# Altium schematic sheet [X] - ETHERNET.SchDoc
size 513 x 386 mm
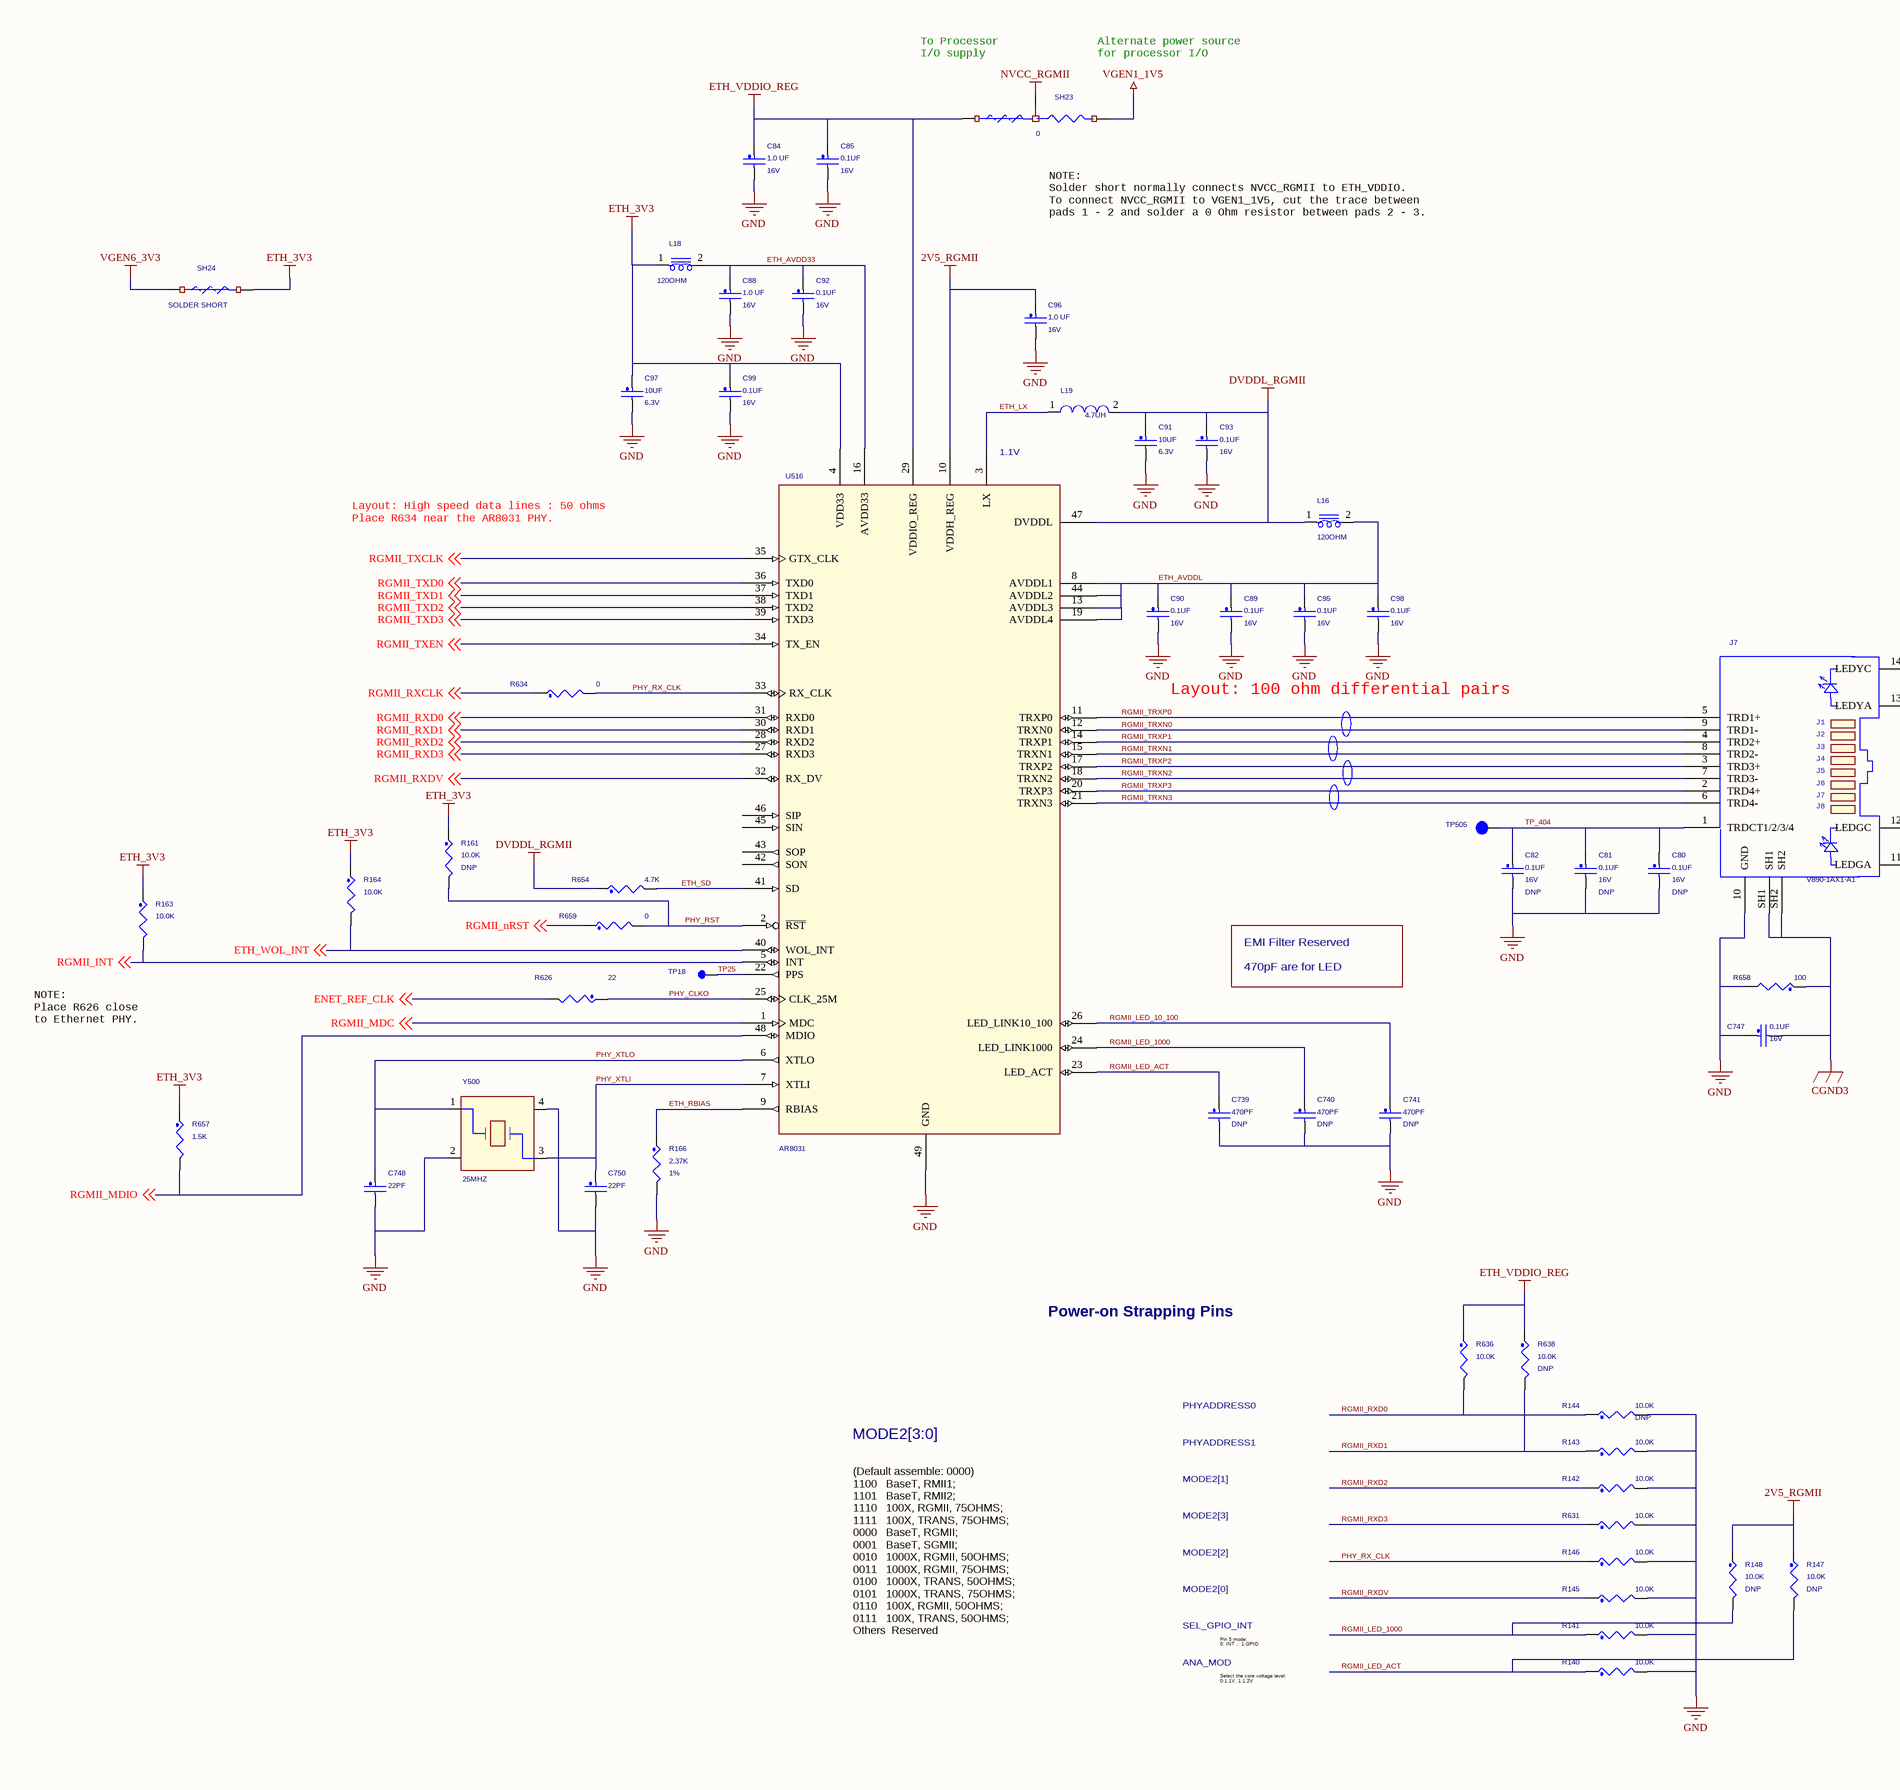
[diagram p0: [X] - ETHERNET.SchDoc, left]
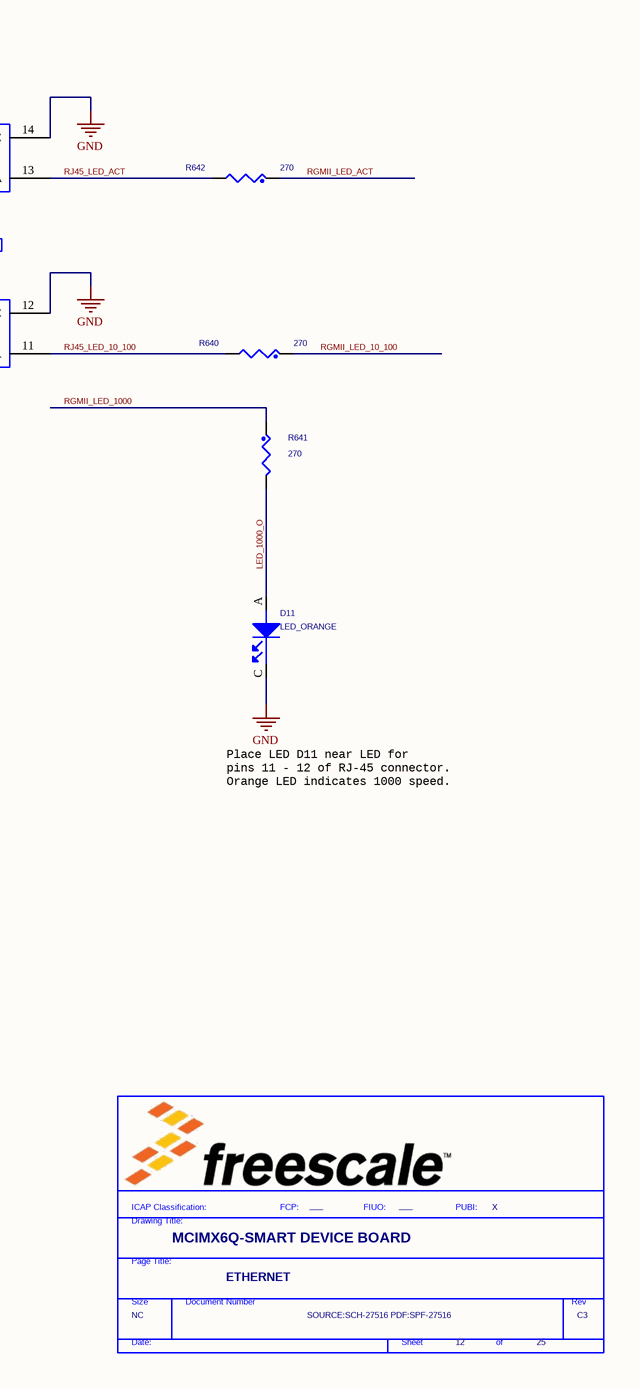
[diagram p1: [X] - ETHERNET.SchDoc, right]

## Parts
*  FIUO: ___  PUBI: X  Doc: SOURCE:SCH-27516 PDF:SPF-27516  RevCode: C3  Title: MCIMX6Q-SMART DEVICE BOARD  Page Size: NC  Page Number: 12  Page Count: 25  PageTitle: ETHERNET  (hidden comment: TitleBlock_FS)  (graphical)
C80  0.1UF  WVDC: 16V  ASSY_OPT: DNP  [0402_CC]
C81  0.1UF  WVDC: 16V  ASSY_OPT: DNP  [0402_CC]
C82  0.1UF  WVDC: 16V  ASSY_OPT: DNP  [0402_CC]
C84  1.0 UF  WVDC: 16V  [0603_CC]
C85  0.1UF  WVDC: 16V  [0402_CC]
C88  1.0 UF  WVDC: 16V  [0603_CC]
C89  0.1UF  WVDC: 16V  [0402_CC]
C90  0.1UF  WVDC: 16V  [0402_CC]
C91  10UF  WVDC: 6.3V  [0603_CC]
C92  0.1UF  WVDC: 16V  [0402_CC]
C93  0.1UF  WVDC: 16V  [0402_CC]
C95  0.1UF  WVDC: 16V  [0402_CC]
C96  1.0 UF  WVDC: 16V  [0603_CC]
C97  10UF  WVDC: 6.3V  [0603_CC]
C98  0.1UF  WVDC: 16V  [0402_CC]
C99  0.1UF  WVDC: 16V  [0402_CC]
C739  470PF  ASSY_OPT: DNP  [0402_CC]
C740  470PF  ASSY_OPT: DNP  [0402_CC]
C741  470PF  ASSY_OPT: DNP  [0402_CC]
C747  0.1UF  WVDC: 16V  [0402_CC]
C748  22PF  [0402_CC]
C750  22PF  [0402_CC]
D11  LED_ORANGE  [LED_0603]
J7  V890-1AX1-A1  [con_rj45_2x5_th]
L16  120OHM  [0603_CC]
L18  120OHM  [0603_CC]
L19  4.7UH  [ind_vls3012_sm]
R140  10.0K  [0402_CC]
R141  10.0K  [0402_CC]
R142  10.0K  [0402_CC]
R143  10.0K  [0402_CC]
R144  10.0K  ASSY_OPT: DNP  [0402_CC]
R145  10.0K  [0402_CC]
R146  10.0K  [0402_CC]
R147  10.0K  ASSY_OPT: DNP  [0402_CC]
R148  10.0K  ASSY_OPT: DNP  [0402_CC]
R161  10.0K  ASSY_OPT: DNP  [0402_CC]
R163  10.0K  [0402_CC]
R164  10.0K  [0402_CC]
R166  2.37K  Tolerance: 1%  [0402_CC]
R626  22  [0603_CC]
R631  10.0K  [0402_CC]
R634  0  [0402_CC]
R636  10.0K  [0402_CC]
R638  10.0K  ASSY_OPT: DNP  [0402_CC]
R640  270  [0402_CC]
R641  270  [0402_CC]
R642  270  [0402_CC]
R654  4.7K  [0402_CC]
R657  1.5K  [0402_CC]
R658  100  [0402_CC]
R659  0  [0402_CC]
SH23  0  [SH0603-X2_PIN1TO2]
SH24  SOLDER SHORT  [SH0805_40]
TP18  TEST POINT  [C035S]  (value not drawn)
TP505  tpad_020  [tpad_020]  (value not drawn)
U516  AR8031  [qfn48_0p4_6x6mm_epad]
Y500  25MHZ  [xtal_4_7p2x5p2]

## Nets
2V5_RGMII: C96.1 R147.1 R148.1 U516.10(VDDH_REG)
CGND3: C747.2 J7.SH1 J7.SH2 R658.1
DVDDL_RGMII: C91.1 C93.1 L16.1 L19.2 R654.1 U516.47(DVDDL)
ETH_3V3: C97.1 C99.1 L18.1 R161.1 R163.1 R164.1 R657.1 SH24.2 U516.4(VDD33)
ETH_VDDIO_REG: C84.1 C85.1 R636.1 R638.1 SH23.1 U516.29(VDDIO_REG)
GND: C80.2 C81.2 C82.2 C84.2 C85.2 C88.2 C89.2 C90.2 C91.2 C92.2 C93.2 C95.2 C96.2 C97.2 C98.2 C99.2 C739.2 C740.2 C741.2 C747.1 C748.2 C750.2 D11.C(CATHODE) J7.10(GND) J7.12(LEDGC) J7.14(LEDYC) R140.2 R141.2 R142.2 R143.2 R144.2 R145.2 R146.2 R166.2 R631.2 R658.2 U516.49(GND) Y500.2 Y500.4
NVCC_RGMII: SH23.2
VGEN1_1V5: SH23.3
VGEN6_3V3: SH24.1
ENET_REF_CLK: R626.2 ; off-sheet ENET_REF_CLK
ETH_AVDD33: C88.1 C92.1 L18.2 U516.16(AVDD33)
ETH_AVDDL: C89.1 C90.1 C95.1 C98.1 L16.2 U516.8(AVDDL1) U516.13(AVDDL3) U516.19(AVDDL4) U516.44(AVDDL2)
ETH_LX: L19.1 U516.3(LX)
ETH_RBIAS: R166.1 U516.9(RBIAS)
ETH_SD: R654.2 U516.41(SD)
ETH_WOL_INT: R164.2 U516.40(WOL_INT) ; off-sheet ETH_WOL_INT
LED_1000_O: D11.A(ANODE) R641.2
PHY_CLKO: R626.1 U516.25(CLK_25M)
PHY_RST: R161.2 R659.2 U516.2(~{RST})
PHY_RX_CLK: R146.1 R634.2 U516.33(RX_CLK)
PHY_XTLI: C750.1 U516.7(XTLI) Y500.3
PHY_XTLO: C748.1 U516.6(XTLO) Y500.1
RGMII_INT: R163.2 U516.5(INT) ; off-sheet RGMII_INT
RGMII_LED_10_100: C741.1 R640.1 U516.26(LED_LINK10_100)
RGMII_LED_1000: C740.1 R141.1 R148.2 R641.1 U516.24(LED_LINK1000)
RGMII_LED_ACT: C739.1 R140.1 R147.2 R642.1 U516.23(LED_ACT)
RGMII_MDC: U516.1(MDC) ; off-sheet RGMII_MDC
RGMII_MDIO: R657.2 U516.48(MDIO) ; off-sheet RGMII_MDIO
RGMII_nRST: R659.1 ; off-sheet RGMII_nRST
RGMII_RXCLK: R634.1 ; off-sheet RGMII_RXCLK
RGMII_RXD0: R144.1 R636.2 U516.31(RXD0) ; off-sheet RGMII_RXD0
RGMII_RXD1: R143.1 R638.2 U516.30(RXD1) ; off-sheet RGMII_RXD1
RGMII_RXD2: R142.1 U516.28(RXD2) ; off-sheet RGMII_RXD2
RGMII_RXD3: R631.1 U516.27(RXD3) ; off-sheet RGMII_RXD3
RGMII_RXDV: R145.1 U516.32(RX_DV) ; off-sheet RGMII_RXDV
RGMII_TRXN0: J7.9(TRD1-) U516.12(TRXN0)
RGMII_TRXN1: J7.8(TRD2-) U516.15(TRXN1)
RGMII_TRXN2: J7.7(TRD3-) U516.18(TRXN2)
RGMII_TRXN3: J7.6(TRD4-) U516.21(TRXN3)
RGMII_TRXP0: J7.5(TRD1+) U516.11(TRXP0)
RGMII_TRXP1: J7.4(TRD2+) U516.14(TRXP1)
RGMII_TRXP2: J7.3(TRD3+) U516.17(TRXP2)
RGMII_TRXP3: J7.2(TRD4+) U516.20(TRXP3)
RGMII_TXCLK: U516.35(GTX_CLK) ; off-sheet RGMII_TXCLK
RGMII_TXD0: U516.36(TXD0) ; off-sheet RGMII_TXD0
RGMII_TXD1: U516.37(TXD1) ; off-sheet RGMII_TXD1
RGMII_TXD2: U516.38(TXD2) ; off-sheet RGMII_TXD2
RGMII_TXD3: U516.39(TXD3) ; off-sheet RGMII_TXD3
RGMII_TXEN: U516.34(TX_EN) ; off-sheet RGMII_TXEN
RJ45_LED_10_100: J7.11(LEDGA) R640.2
RJ45_LED_ACT: J7.13(LEDYA) R642.2
TP25: TP18.1(Pin1) U516.22(PPS)
TP_404: C80.1 C81.1 C82.1 J7.1(TRDCT1/2/3/4) TP505.1(Pin1)

Not connected (* = marked no-connect by the designer): U516 42(SON) 43(SOP) 45(SIN) 46(SIP)

## Notes on the sheet
- (near SH23) To Processor
  I/O supply
- (near SH23) Alternate power source
  for processor I/O
- NOTE:
  Solder short normally connects NVCC_RGMII to ETH_VDDIO.
  To connect NVCC_RGMII to VGEN1_1V5, cut the trace between
  pads 1 - 2 and solder a 0 Ohm resistor between pads 2 - 3.
- (near U516) 1.1V
- (near U516) Layout: High speed data lines : 50 ohms
  Place R634 near the AR8031 PHY.
- Layout: 100 ohm differential pairs
- EMI Filter Reserved
- NOTE:
  Place R626 close
  to Ethernet PHY.
- 470pF are for LED
- Place LED D11 near LED for
  pins 11 - 12 of RJ-45 connector.
  Orange LED indicates 1000 speed.
- Power-on Strapping Pins
- MODE2[3:0]
- PHYADDRESS0
- (Default assemble: 0000)
  1100   BaseT, RMII1;
  1101   BaseT, RMII2;
  1110   100X, RGMII, 75OHMS;
  1111   100X, TRANS, 75OHMS;
  0000   BaseT, RGMII;
  0001   BaseT, SGMII;
  0010   1000X, RGMII, 50OHMS;
  0011   1000X, RGMII, 75OHMS;
  0100   1000X, TRANS, 50OHMS;
  0101   1000X, TRANS, 75OHMS;
  0110   100X, RGMII, 50OHMS;
  0111   100X, TRANS, 50OHMS;
  Others  Reserved
- PHYADDRESS1
- MODE2[1]
- MODE2[2]
- MODE2[3]
- MODE2[0]
- SEL_GPIO_INT
- ANA_MOD
- Pin 5 mode:
  0: INT ;  1:GPIO
- Select the core voltage level:
  0:1.1V, 1:1.2V
- (in symbol TitleBlock_FS) ICAP Classification:; FCP:; FIUO:; PUBI:; Drawing Title:; Page Title:; Size; Document Number; Rev; Date:; Sheet; of
- (in symbol V890-1AX1-A1_14P) J1; J2; J3; J4; J5; J6; J8

## Library data of the parts
* = TitleBlock_FS: OrgName: Freescale Semiconductor; OrgAddr1: 6501 William Cannon Drive West; OrgAddr2: Austin, TX 78735-8598; FCP: ___; Page Create Date: March  8, 1995
C80-C82 = CAP_NP: CAP CER 0.1UF 16V 10% X7R 0402; CLASS: DISCRETE; ROOM: RGMII_PHY; FPLIST: CC0402_25,CC0402_HD,0402_CC; CAD_APPROVED: Yes; MFG_PN01: C0402C104K4RAC; MFG_NAME01: KEMET; AGILE_PN: 150-75182; PRIORITY_PN: 021-00196; SIGNAL_MODEL: DEFAULT_CAPACITOR_100000pF_2_1; TOL: 10%; HEIGHT: 0.635MM; ROHS: Yes; Tolerance: 10%; VOLTAGE: 16V
C84 C96 = CAP_NP: CAP CER 1.0UF 16V 10% X7R 0603; CLASS: DISCRETE; ROOM: RGMII_PHY; AGILE_PN: 150-30028; MFG_NAME01: AVX; MFG_PN01: 0603YC105KAT2A; CAD_APPROVED: Yes; FPLIST: CC0603_OV,CC0603,0603_CC; PRIORITY_PN: 021-00172; SIGNAL_MODEL: DEFAULT_CAPACITOR_1e+06pF_2_1; Tolerance: 10%; ROHS: Yes; HEIGHT: 1.0MM; VOLTAGE: 16V
C85 C90 C92 C93 C95 C98 C747 = CAP_NP: CAP CER 0.1UF 16V 10% X7R 0402; CLASS: DISCRETE; FPLIST: CC0402_25,CC0402_HD,0402_CC; CAD_APPROVED: Yes; MFG_PN01: C0402C104K4RAC; MFG_NAME01: KEMET; AGILE_PN: 150-75182; SIGNAL_MODEL: DEFAULT_CAPACITOR_100000pF_2_1; HEIGHT: 0.635MM; ROHS: Yes; Tolerance: 10%; VOLTAGE: 16V
C88 = CAP_NP: CAP CER 1.0UF 16V 10% X7R 0603; CLASS: DISCRETE; FPLIST: CC0603_OV,CC0603,0603_CC; ROOM: RGMII_PHY; PRIORITY_PN: 021-00257; CAD_APPROVED: Yes; MFG_PN01: 0603YC105KAT2A; MFG_NAME01: AVX; AGILE_PN: 150-30028; SIGNAL_MODEL: DEFAULT_CAPACITOR_1e+06pF_2_1; HEIGHT: 1.0MM; ROHS: Yes; Tolerance: 10%; VOLTAGE: 16V
C89 C99 = CAP_NP: CAP CER 0.1UF 16V 10% X7R 0402; CLASS: DISCRETE; AGILE_PN: 150-75182; MFG_NAME01: KEMET; MFG_PN01: C0402C104K4RAC; CAD_APPROVED: Yes; FPLIST: CC0402_25,CC0402_HD,0402_CC; SIGNAL_MODEL: DEFAULT_CAPACITOR_100000pF_2_1; Tolerance: 10%; ROHS: Yes; HEIGHT: 0.635MM; VOLTAGE: 16V
C91 = CAP_NP: CAP CER 10UF 6.3V 10% X5R 0603; CLASS: DISCRETE; PRIORITY_PN: 021-00276; FPLIST: CC0603_OV,CC0603,0603_CC; CAD_APPROVED: Yes; MFG_PN01: C1608X5R0J106KT; MFG_NAME01: TDK; AGILE_PN: 150-77832; ROOM: RGMII_PHY; SIGNAL_MODEL: DEFAULT_CAPACITOR_1e+07pF_2_1; HEIGHT: 1.0MM; ROHS: Yes; Tolerance: 10%; VOLTAGE: 6.3V
C97 = CAP_NP: CAP CER 10UF 6.3V 10% X5R 0603; CLASS: DISCRETE; ROOM: RGMII_PHY; AGILE_PN: 150-77832; MFG_NAME01: TDK; MFG_PN01: C1608X5R0J106KT; CAD_APPROVED: Yes; FPLIST: CC0603_OV,CC0603,0603_CC; PRIORITY_PN: 021-00276; SIGNAL_MODEL: DEFAULT_CAPACITOR_1e+07pF_2_1; Tolerance: 10%; ROHS: Yes; HEIGHT: 1.0MM; VOLTAGE: 6.3V
C739-C741 = CAP_NP: CAP CER 470PF 50V 10% X7R 0402; CLASS: DISCRETE; ROOM: RGMII_PHY; AGILE_PN: 150-75452; MFG_NAME01: MURATA; MFG_PN01: GRM155R71H471KA01D; CAD_APPROVED: Yes; FPLIST: CC0402_25,CC0402_HD,0402_CC; PRIORITY_PN: 021-00340; SIGNAL_MODEL: DEFAULT_CAPACITOR_470pF_2_1; Tolerance: 10%; ROHS: Yes; HEIGHT: 0.55MM; VOLTAGE: 50V
C748 = CAP_NP: CAP CER 22PF 50V 5% C0G 0402; CLASS: DISCRETE; ROOM: RGMII_PHY; PRIORITY_PN: 021-00234; FPLIST: CC0402_25,CC0402_HD,0402_CC; CAD_APPROVED: Yes; MFG_PN01: 04025A220JAT2A; MFG_NAME01: AVX; AGILE_PN: 150-75266; SIGNAL_MODEL: DEFAULT_CAPACITOR_22pF_2_1; HEIGHT: 0.635MM; ROHS: Yes; Tolerance: 5%; VOLTAGE: 50V
C750 = CAP_NP: CAP CER 22PF 50V 5% C0G 0402; CLASS: DISCRETE; AGILE_PN: 150-75266; MFG_NAME01: AVX; MFG_PN01: 04025A220JAT2A; CAD_APPROVED: Yes; FPLIST: CC0402_25,CC0402_HD,0402_CC; PRIORITY_PN: 021-00234; ROOM: RGMII_PHY; SIGNAL_MODEL: DEFAULT_CAPACITOR_22pF_2_1; Tolerance: 5%; ROHS: Yes; HEIGHT: 0.635MM; VOLTAGE: 50V
D11 = LED: LED SUPER BRIGHT ORANGE SMD 0603; CLASS: IC; AGILE_PN: 370-75145; MFG_NAME01: KINGBRIGHT; MFG_PN01: AP1608SEC; CAD_APPROVED: Yes; ROHS: Yes; HEIGHT: 1.1mm
J7 = V890-1AX1-A1_14P: CON 10 RJ-45 SHLD TH G/Y LEDS 50MIL SP 662H AU 125L; CLASS: IO; CAD_APPROVED: Yes; MFG_NAME01: BEL FUSE; AGILE_PN: 210-79982; HEIGHT: 16.814MM; ROHS: Yes; MFG_PN01: V890-1AX1-A1
L16 = BEAD_0: IND FER BEAD 120OHM@100MHZ 2A 25% 0603; PART_TYPE: FERRITE; CLASS: DISCRETE; ROOM: RGMII_PHY; PRIORITY_PN: 024-00067; MFG_NAME01: MURATA; CAD_APPROVED: Yes; FPLIST: IND_0603,0603_CC; AGILE_PN: 180-30008; MFG_PN01: BLM18PG121SH1; Tolerance: 25%; HEIGHT: 0.95MM; ROHS: Yes
L18 = BEAD_0: IND FER BEAD 120OHM@100MHZ 2A 25% 0603; PART_TYPE: FERRITE; CLASS: DISCRETE; PRIORITY_PN: 024-00067; MFG_NAME01: MURATA; CAD_APPROVED: Yes; FPLIST: IND_0603,0603_CC; AGILE_PN: 180-30008; MFG_PN01: BLM18PG121SH1; ROOM: RGMII_PHY; Tolerance: 25%; HEIGHT: 0.95MM; ROHS: Yes
L19 = INDUCTOR: IND PWR 4.7UH@1MHZ 1A 20% SMD; PART_TYPE: INDUCTOR\POWER; CLASS: DISCRETE; ROOM: RGMII_PHY; AGILE_PN: 180-77706; MFG_NAME01: TDK; MFG_PN01: VLS3012T-4R7M1R0; CAD_APPROVED: Yes; PRIORITY_PN: 024-00152; SIGNAL_MODEL: DEFAULT_INDUCTOR_4700nH_2_1; Tolerance: 20%; ROHS: Yes; HEIGHT: 1.2MM
R140-R148 = RES: RES MF 10.0K 1/16W 1% 0402; CLASS: DISCRETE; AGILE_PN: 470-75416; MFG_NAME01: VISHAY INTERTECHNOLOGY; MFG_PN01: CRCW040210K0FKED; CAD_APPROVED: Yes; FPLIST: RC0402_25,RC0402_HD,0402_CC; PRIORITY_PN: 006-00552; ROOM: RGMII_PHY; SIGNAL_MODEL: DEFAULT_RESISTOR_10000OHM_2_1; Tolerance: 1%; ROHS: Yes
R161 R163 = RES: RES MF 10.0K 1/16W 1% 0402; CLASS: DISCRETE; FPLIST: RC0402_25,RC0402_HD,0402_CC; CAD_APPROVED: Yes; MFG_PN01: CRCW040210K0FKED; MFG_NAME01: VISHAY INTERTECHNOLOGY; AGILE_PN: 470-75416; SIGNAL_MODEL: DEFAULT_RESISTOR_10000OHM_2_1; ROHS: Yes; Tolerance: 1%
R164 = RES: RES MF 10.0K 1/16W 1% 0402; CLASS: DISCRETE; AGILE_PN: 470-75416; MFG_NAME01: VISHAY INTERTECHNOLOGY; MFG_PN01: CRCW040210K0FKED; CAD_APPROVED: Yes; FPLIST: RC0402_25,RC0402_HD,0402_CC; SIGNAL_MODEL: DEFAULT_RESISTOR_10000OHM_2_1; Tolerance: 1%; ROHS: Yes
R166 = RES: RES MF 2.37K  1/16W 1% 0402; CLASS: DISCRETE; PRIORITY_PN: 006-01003; FPLIST: RC0402_25,RC0402_HD,0402_CC; CAD_APPROVED: Yes; MFG_PN01: RK73H1ETTP2371F; MFG_NAME01: KOA SPEER; AGILE_PN: 470-30874; ROOM: RGMII_PHY; SIGNAL_MODEL: DEFAULT_RESISTOR_2370OHM_2_1; ROHS: Yes
R626 = RES: RES MF 22.0 OHM 1/10W 1% 0603; CLASS: DISCRETE; FPLIST: RC0603_OV,RC0603,0603_CC; CAD_APPROVED: Yes; MFG_PN01: RK73H1JTTD22R0F; MFG_NAME01: KOA SPEER; AGILE_PN: 470-75425; SIGNAL_MODEL: DEFAULT_RESISTOR_22OHM_2_1; ROHS: Yes; Tolerance: 1%
R631 = RES: RES MF 10.0K 1/16W 1% 0402; CLASS: DISCRETE; ROOM: RGMII_PHY; PRIORITY_PN: 006-00552; FPLIST: RC0402_25,RC0402_HD,0402_CC; CAD_APPROVED: Yes; MFG_PN01: CRCW040210K0FKED; MFG_NAME01: VISHAY INTERTECHNOLOGY; AGILE_PN: 470-75416; SIGNAL_MODEL: DEFAULT_RESISTOR_10000OHM_2_1; ROHS: Yes; Tolerance: 1%
R634 R659 = RES: RES MF ZERO OHM 1/10W -- 0402; CLASS: DISCRETE; FPLIST: RC0402_25,RC0402_HD,RC0402_X2,0402_CC; CAD_APPROVED: Yes; MFG_PN01: ERJ-2GE0R00X; MFG_NAME01: Panasonic; AGILE_PN: 470-79965; SIGNAL_MODEL: DEFAULT_RESISTOR_0.001OHM_2_1; ROHS: Yes
R636 = RES: RES MF 10.0K 1/16W 1% 0402; CLASS: DISCRETE; AGILE_PN: 470-75416; MFG_NAME01: VISHAY INTERTECHNOLOGY; MFG_PN01: CRCW040210K0FKED; CAD_APPROVED: Yes; FPLIST: RC0402_25,RC0402_HD,0402_CC; PRIORITY_PN: 006-00552; ROOM: RGMII_PHY; Tolerance: 1%; ROHS: Yes
R638 = RES: RES MF 10.0K 1/16W 1% 0402; CLASS: DISCRETE; ROOM: RGMII_PHY; PRIORITY_PN: 006-00552; FPLIST: RC0402_25,RC0402_HD,0402_CC; CAD_APPROVED: Yes; MFG_PN01: CRCW040210K0FKED; MFG_NAME01: VISHAY INTERTECHNOLOGY; AGILE_PN: 470-75416; ROHS: Yes; Tolerance: 1%
R640 R642 = RES: RES MF 270 OHM 1/16W 5% 0402; CLASS: DISCRETE; AGILE_PN: 470-30332; MFG_NAME01: VISHAY INTERTECHNOLOGY; MFG_PN01: CRCW0402270RJNED; CAD_APPROVED: Yes; FPLIST: RC0402_25,RC0402_HD,0402_CC; SIGNAL_MODEL: DEFAULT_RESISTOR_270OHM_2_1; Tolerance: 5%; ROHS: Yes
R641 = RES: RES MF 270 OHM 1/16W 5% 0402; CLASS: DISCRETE; FPLIST: RC0402_25,RC0402_HD,0402_CC; CAD_APPROVED: Yes; MFG_PN01: CRCW0402270RJNED; MFG_NAME01: VISHAY INTERTECHNOLOGY; AGILE_PN: 470-30332; SIGNAL_MODEL: DEFAULT_RESISTOR_270OHM_2_1; ROHS: Yes; Tolerance: 5%
R654 = RES: RES MF 4.70K 1/16W 1% 0402; CLASS: DISCRETE; ROOM: RGMII_PHY; PRIORITY_PN: 006-00619; FPLIST: RC0402_25,RC0402_HD,0402_CC; CAD_APPROVED: Yes; MFG_PN01: RK73H1ETTP4701F; MFG_NAME01: KOA SPEER; AGILE_PN: 470-75418; SIGNAL_MODEL: DEFAULT_RESISTOR_4700OHM_2_1; ROHS: Yes; Tolerance: 1%
R657 = RES: RES MF 1.50K 1/16W 1% 0402; CLASS: DISCRETE; AGILE_PN: 470-76065; MFG_NAME01: VIKING TECH CORPORATION; MFG_PN01: CR-02FL6---1K5; CAD_APPROVED: Yes; PRIORITY_PN: 006-00654; ROOM: RGMII_PHY; SIGNAL_MODEL: DEFAULT_RESISTOR_1500OHM_2_1; ASSY_NOTE: 470-76065; ROHS: Yes; TOLERANCE: 1%
R658 = RES: RES MF 100 OHM 1/16W 1% 0402; CLASS: DISCRETE; FPLIST: RC0402_25,RC0402_HD,0402_CC; CAD_APPROVED: Yes; MFG_PN01: CR-02FL6--100R; MFG_NAME01: THYE MING TECH CO LTD; AGILE_PN: 470-30454; SIGNAL_MODEL: DEFAULT_RESISTOR_100OHM_2_1; ROHS: Yes; Tolerance: 1%
SH23 = RES_SHORT-3_1TO2: ZERO OHM CUT TRACE 0603 PADS; NO PART TO ORDER; CLASS: DISCRETE; FPLIST: SH0603,SH0603_CC,SH0603-X2_PIN1TO2,SH0603-X2_PIN2TO3; CAD_APPROVED: Yes; ASSY_OPT: DNP; MFG_PN01: LAYOUT ELEMENT ONLY; AGILE_PN: 470-80018; ROHS: Yes; MFG_NAME01: LAYOUT ELEMENT ONLY
SH24 = RES_SHORT-2: SOLDER SHORT 0805  SMT NO PART TO ORDER; CLASS: DISCRETE; AGILE_PN: 470-80202; MFG_NAME01: NOTACOMPONENT; MFG_PN01: SOLDER_SHORT_0805; ASSY_OPT: DNP; CAD_APPROVED: Yes; FPLIST: SH0805,SH0805CUST,SH0805_40; ROHS: Yes
TP18 = Test pad: TEST POINT PAD 35 MIL SMT, NO PART TO ORDER; CLASS: IC; AGILE_PN: 280-75148; MFG_NAME01: NA; ASSY_OPT: DNP; CAD_APPROVED: Yes; ROOM: CODEC; MFG_PN01: NA; ROHS: Yes; HEIGHT: 0.1 MM
TP505 = TESTLOOP: TEST POINT PAD 0.5MM DIA SMT, NO PART TO ORDER; CLASS: IO; AGILE_PN: 211-77484; ASSY_OPT: DNP; CAD_APPROVED: Yes; ROHS: Yes; HEIGHT: 0.1MM
U516 = AR8031_QFN48: IC XCVR ETHERNET PHY 10/100/1000G-BIT 3.3V QFN48; CAD_APPROVED: Yes; MFG_PN01: AR8031-AL1A; MFG_NAME01: Atheros Communications, Inc; AGILE_PN: 312-80115; CLASS: IC; HEIGHT: 0.8MM; ROHS: Yes
Y500 = XTAL_13Y: XTAL 25MHZ -- -- SMT; CLASS: IC; CAD_APPROVED: Yes; MFG_PN01: ABMM-25.000MHZ-B2-T; MFG_NAME01: ABRACON CORP; AGILE_PN: 230-77853; HEIGHT: 1.3MM; ROHS: Yes